# Altium schematic sheet LPCB230 - TC INTERFACE.SchDoc
size A3; Address1: Factory 10; Address2: 9-13 Dingley Avenue, Dandeong, VICTORIA 3175, AUSTRALIA; DocumentNumber: 2; Revision: 1; SheetNumber: 2; SheetTotal: 3; Lockie__PCB_SUB_ASSEMBLY: Interface; Lockie__PCB_ASSEMBLY: Interface; Lockie__LDL: LPCB230; Lockie__PCB_DESCRIPTION: Thermocouple Interface
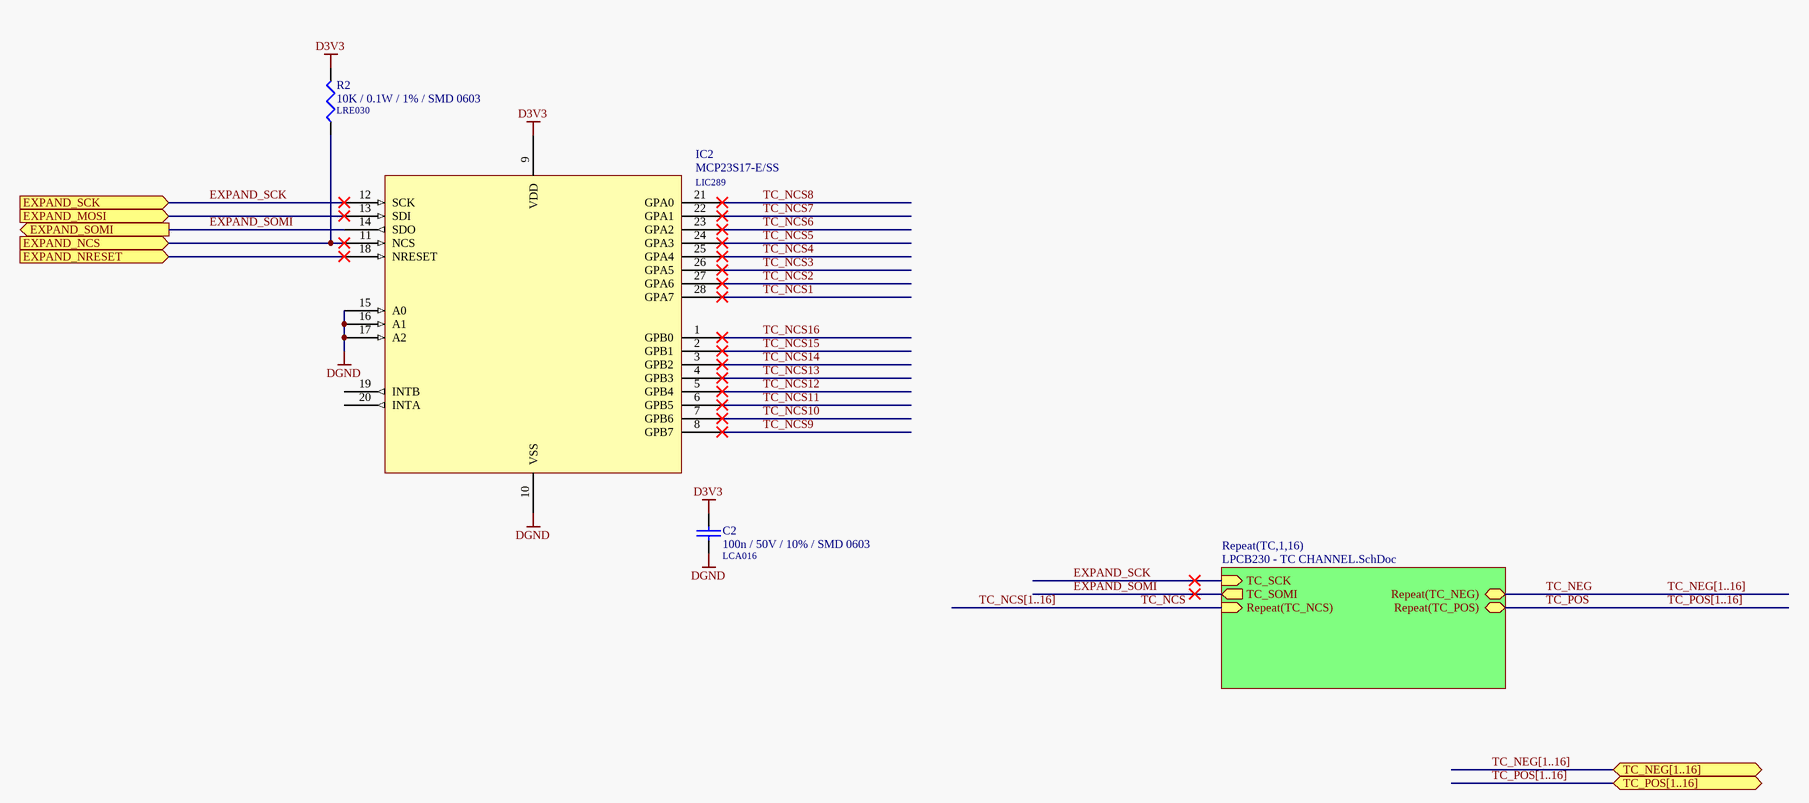
[diagram p0: LPCB230 - TC INTERFACE.SchDoc]

## Parts
C2  100n / 50V / 10% / SMD 0603  LDL_NUMBER: LCA016  [LFP011__CC1608-0603-IPC7351_B]
IC2  MCP23S17-E/SS  LDL_NUMBER: LIC289  [LFP050__SSOP28]
R2  10K / 0.1W / 1% / SMD 0603  LDL_NUMBER: LRE030  [LFP020__CR1608-0603-IPC7351_B]

## Sub-sheets
Repeat(TC,1,16) = LPCB230 - TC CHANNEL.SchDoc: Repeat(TC_NEG) (bidir), Repeat(TC_POS) (bidir), TC_SCK (in), TC_SOMI (out), Repeat(TC_NCS) (in)

## Ports
EXPAND_MOSI (in), EXPAND_NCS (in), EXPAND_NRESET (in), EXPAND_SCK (in), EXPAND_SOMI (out), TC_NEG[1..16] (bidir), TC_POS[1..16] (bidir)

## Nets
D3V3: C2.1 IC2.9(VDD) R2.2
DGND: C2.2 IC2.10(VSS) IC2.15(A0) IC2.16(A1) IC2.17(A2)
EXPAND_MOSI: IC2.13(SDI) ; port EXPAND_MOSI
EXPAND_NCS: IC2.11(NCS) R2.1 ; port EXPAND_NCS
EXPAND_NRESET: IC2.18(NRESET) ; port EXPAND_NRESET
EXPAND_SCK: IC2.12(SCK) ; port EXPAND_SCK, sheet Repeat(TC,1,16)/TC_SCK
EXPAND_SOMI: IC2.14(SDO) ; port EXPAND_SOMI, sheet Repeat(TC,1,16)/TC_SOMI
TC_NCS: sheet Repeat(TC,1,16)/Repeat(TC_NCS)
TC_NCS1: IC2.28(GPA7)
TC_NCS2: IC2.27(GPA6)
TC_NCS3: IC2.26(GPA5)
TC_NCS4: IC2.25(GPA4)
TC_NCS5: IC2.24(GPA3)
TC_NCS6: IC2.23(GPA2)
TC_NCS7: IC2.22(GPA1)
TC_NCS8: IC2.21(GPA0)
TC_NCS9: IC2.8(GPB7)
TC_NCS10: IC2.7(GPB6)
TC_NCS11: IC2.6(GPB5)
TC_NCS12: IC2.5(GPB4)
TC_NCS13: IC2.4(GPB3)
TC_NCS14: IC2.3(GPB2)
TC_NCS15: IC2.2(GPB1)
TC_NCS16: IC2.1(GPB0)
TC_NEG: sheet Repeat(TC,1,16)/Repeat(TC_NEG)
TC_POS: sheet Repeat(TC,1,16)/Repeat(TC_POS)

Not connected (* = marked no-connect by the designer): IC2 19(INTB) 20(INTA)

## Buses and harness runs
bus TC_NCS[1..16]
bus TC_NEG[1..16]
bus TC_NEG[1..16] = port TC_NEG[1..16]
bus TC_POS[1..16]
bus TC_POS[1..16] = port TC_POS[1..16]

## Notes on the sheet
- PCB COMPONENT DESCRIPTION
- LDL NUMBER
- Assembly Details
- Size
- Drawing File Name
- Revision
- http://rloop.org
- Scale
- A3
- Sheet Details
- N.T.S
- Sheet:
- Of:

## Library data of the parts
C2 = 100n / 50V / 10% / SMD 0603: Capacitor, Ceramic Chip, 100nF (0.1uF), 50V, 5%, SMD 0603 [LCA016]; FMEDA__OPERATING__VOLTAGE_MIN: 0; FMEDA__OPERATING__VOLTAGE_MAX: 3.3; FMEDA__OPERATING__TEMP_MIN: -20; FMEDA__OPERATING__TEMP_TYP: 27; FMEDA__OPERATING__TEMP_MAX: 50; FMEDA__CHANNEL: COM; Value: 100n; FMEDA__FUNCTION_IN_SYSTEM: *; FMEDA__OPERATING__VOLTAGE_TYP: 3.3
IC2 = MCP23S17-E/SS: IC, SPI IO Expander, 16bit, SMD SSOP28 [LIC289]; FMEDA__OPERATING__TEMP_MIN: -20; FMEDA__OPERATING__TEMP_TYP: 27; FMEDA__OPERATING__TEMP_MAX: 50; FMEDA__OPERATING__VOLTAGE_MIN: 0; FMEDA__OPERATING__VOLTAGE_TYP: 3.3; FMEDA__CHANNEL: COM; FMEDA__FUNCTION_IN_SYSTEM: *; FMEDA__OPERATING__VOLTAGE_MAX: 3.3
R2 = 10K / 0.1W / 1% / SMD 0603: Resistor, Ceramic Chip, 10K, 0.1W, 1%, SMD 0603 [LRE030]; FMEDA__OPERATING__POWER_MAX: 0; FMEDA__OPERATING__TEMP_MAX: 50; FMEDA__OPERATING__TEMP_MIN: -20; FMEDA__OPERATING__TEMP_TYP: 27; FMEDA__CHANNEL: COM; Value: 10K; FMEDA__OPERATING__POWER_MIN: 0; FMEDA__OPERATING__VOLTAGE_MAX: 0; FMEDA__OPERATING__VOLTAGE_MIN: 0; FMEDA__OPERATING__VOLTAGE_TYP: 0; FMEDA__FUNCTION_IN_SYSTEM: *